# EAGLE design Jar of Fireflies (rev B) (EAGLE 7.1.0)
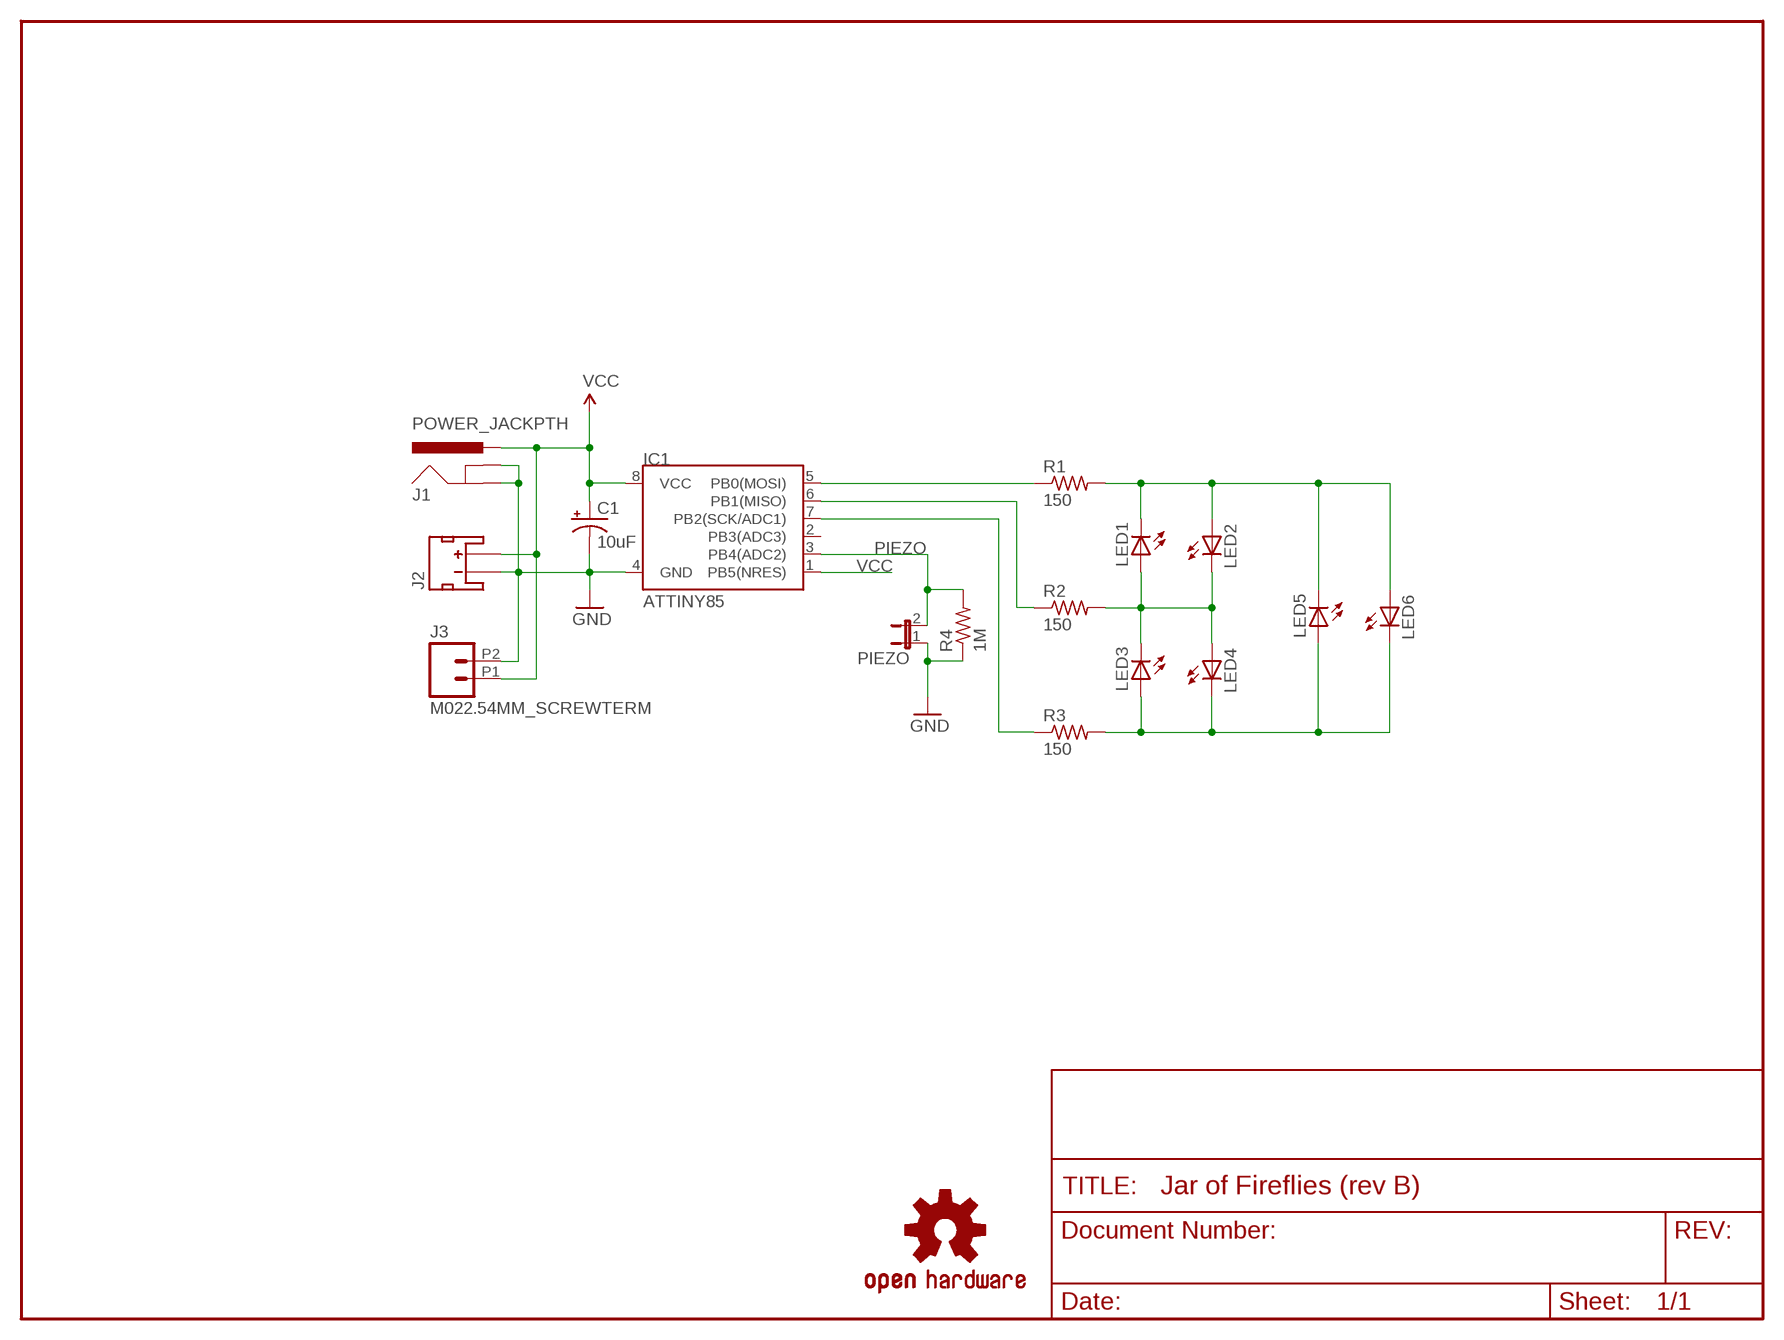
[diagram p0: schematic, sheet 1]

## Parts
C1  10uF  CAP_POLPTH2  [CPOL-RADIAL-10UF-25V]
IC1  ATTINY85  ATTINY45DIP8  [DIP08]
J1  POWER_JACKPTH  [POWER_JACK_PTH]
J2  JST_2MM_MALE  [JST-2-SMD]
J3  M022.54MM_SCREWTERM  [1X02_2.54_SCREWTERM]
LED1  LED5MM  [LED5MM]
LED2  LED5MM  [LED5MM]
LED3  LED5MM  [LED5MM]
LED4  LED5MM  [LED5MM]
LED5  LED5MM  [LED5MM]
LED6  LED5MM  [LED5MM]
LOGO1  OSHW-LOGOL  [OSHW-LOGO-L]
PIEZO  JUMPER-2PTH  [1X02]
R1  150  R-US_0207/2V  [0207/2V]
R2  150  R-US_0204/7  [0204/7]
R3  150  R-US_0207/2V  [0207/2V]
R4  1M  R-US_0204/7  [0204/7]

## Nets
GND: C1.2(-) IC1.4(GND) J1.GND J1.GNDBREAK J2.1(-) J3.P2 PIEZO.1 R4.1
N$1: LED1.A LED2.K(C) LED3.K(C) LED4.A R2.2
N$2: LED1.K(C) LED2.A LED5.K(C) LED6.A R1.2
N$3: LED3.A LED4.K(C) LED5.A LED6.K(C) R3.2
PIEZO: IC1.3(PB4(ADC2)) PIEZO.2 R4.2
PORTA: IC1.5(PB0(MOSI)) R1.1
PORTB: IC1.6(PB1(MISO)) R2.1
PORTC: IC1.7(PB2(SCK/ADC1)) R3.1
VCC: C1.1(+) IC1.1(PB5(NRES)) IC1.8(VCC) J1.PWR J2.2(+) J3.P1
Unconnected: IC1.2(PB3(ADC3)) J2.NC1(PAD1) J2.NC2(PAD2)

## Library data of the parts
C1 = SparkFun-Capacitors:CAP_POL: Capacitor Polarized These are standard SMD and PTH capacitors. Normally 10uF, 47uF, and 100uF in electrolytic and tantalum varieties. Always verify the external diameter of the through hole cap, it varies with capacity, voltage, and manufacturer. The EIA devices should be standard.
IC1 = SparkFun:ATTINY45: Atmel ATTiny45
J1 = SparkFun-Connectors:POWER_JACK: Power Jack This is the standard 5.5mm barrel jack for power. The PTH is the most common, proven, reliable, footprint. The Slot footprint only works if the mill layer is transmitted to the PCB fab house so be warned. Spark Fun Electronics SKU : PRT-00119 SMT: CONN-08106 Mating wall wart : TOL-00298 (and others)
J2 = SparkFun-Connectors:JST_2MM_MALE: Mates to single-cell LiPo batteries. CONN-08352; PROD_ID: CONN-08352
J3 = SparkFun-Connectors:M02: Standard 2-pin 0.1" header. Use with - straight break away headers ( PRT-00116) - right angle break away headers (PRT-00553) - swiss pins (PRT-00743) - machine pins (PRT-00117) - female headers (PRT-00115) Molex polarized connector foot print use with: PRT-08233 with associated crimp pins and housings. 2.54_SCREWTERM for use with PRT-10571. 3.5mm Screw Terminal footprints for PRT-08084 5mm Screw Terminal footprints for use with PRT-08433
LED1-LED6 = SparkFun:LED: LEDs Standard schematic elements and footprints for 5mm, 3mm, 1206, and 0603 sized LEDs. 5mm - Spark Fun Electronics SKU : COM-00529 (and others)
LOGO1 = SparkFun-Aesthetics:OSHW-LOGO: Open Source Hardware Logo This logo indicates the piece of hardware it is found on incorporates a OSHW license and/or adheres to the definition of open source hardware found here: http://freedomdefined.org/OSHW
PIEZO = SparkFun:JUMPER-2: Jumper Basic 0.1" spaced jumper. Use with breakaway headers.
R1-R4 = resistor:R-US_: RESISTOR, American symbol

## Board
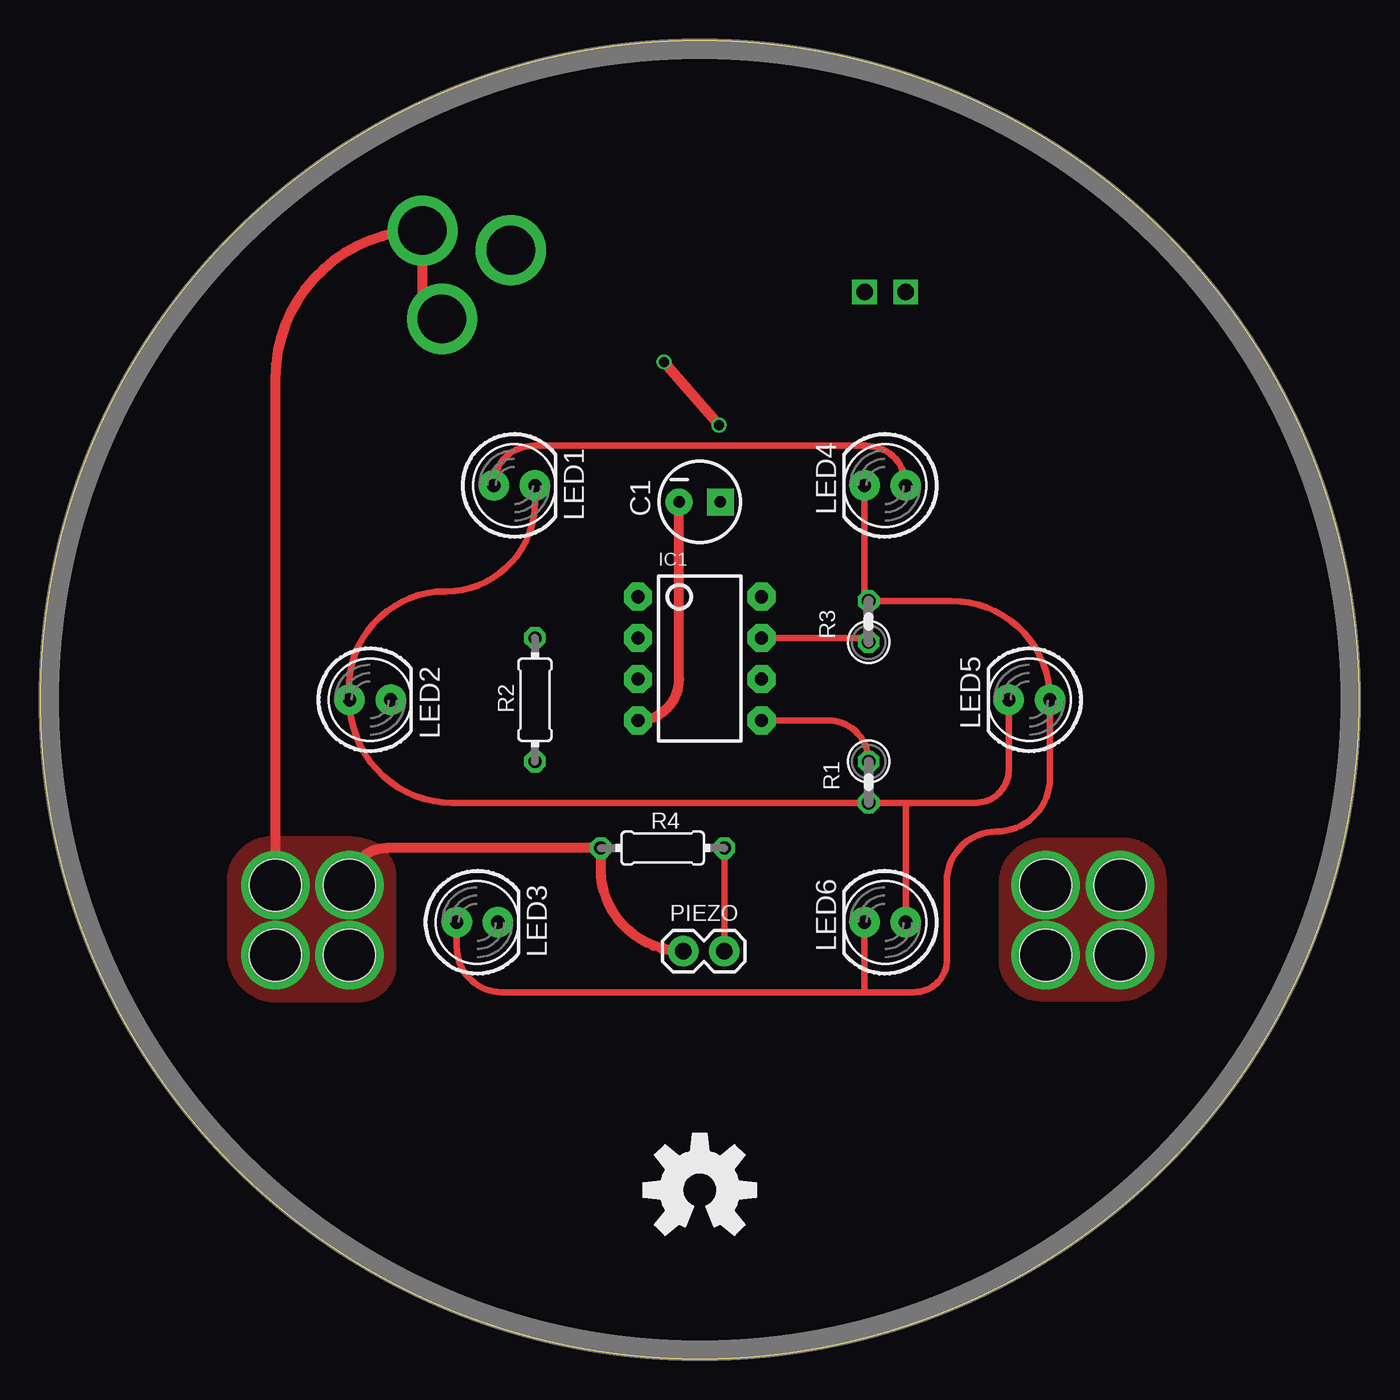
[diagram p1: board, top side]
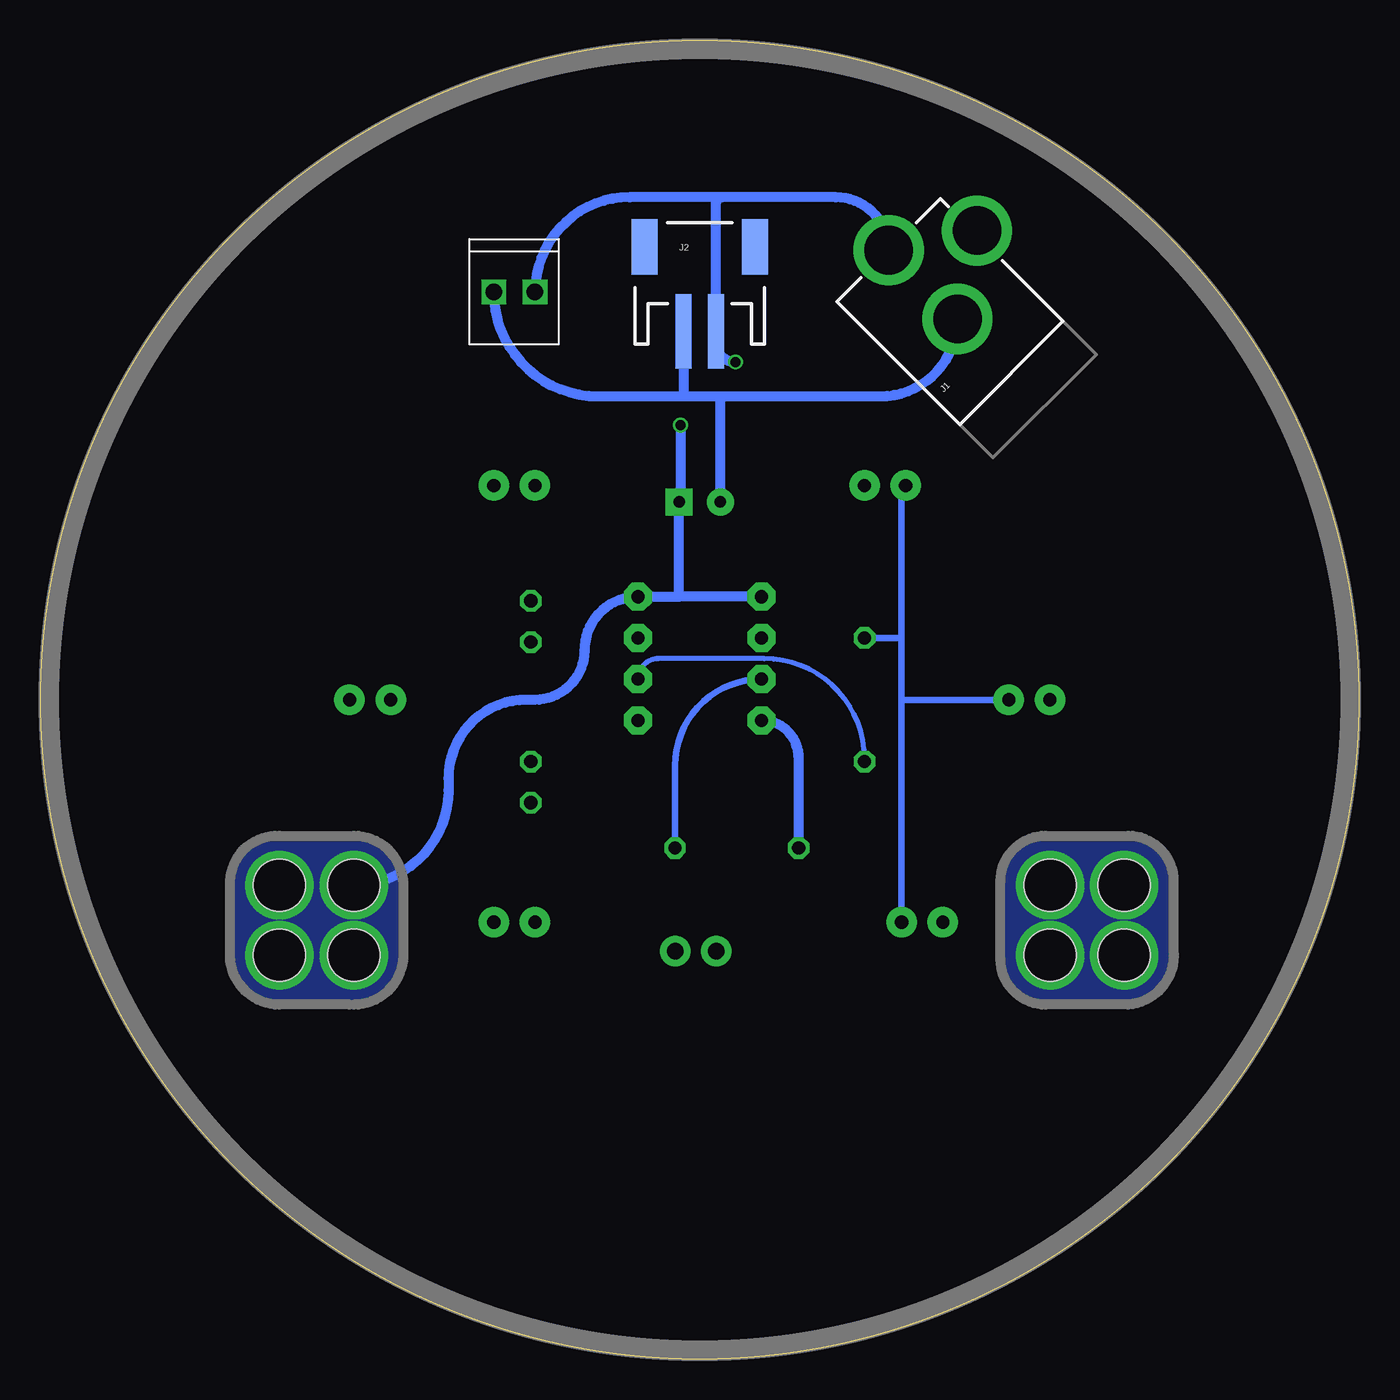
[diagram p2: board, bottom side, seen from below]

Size 81.28 x 81.28 mm. Coordinates in mm from the lower left corner, seen from the top.
Outline: circle at 40.64,40.64 radius 40.64
Copper layers (1*16): Top 0.035mm / dielectric 1.5mm / Bottom 0.035mm
Design rules "SeeedStudio_2layer_DRU_no_angle_20140221": minimum track width 6mil, minimum drill 12mil, track to track 6mil, track to pad 6mil, pad to pad 6mil, via to via 6mil, smd to smd 0mil, copper to edge 10mil, drill to drill 10mil, minimum pad ring 10mil, minimum via ring 6mil, stop-mask expansion 2mil, vias tented up to drill 100mil, thermal gap 10mil
Holes 3.2 mm at 19.05,24.89 19.05,29.21 61.98,29.21 61.98,24.89 14.48,29.21 14.48,24.89 66.55,29.21 66.55,24.89

### Footprints (pad centres in the part's own frame; a part is rotated, then mirrored left to right if it is on the bottom)
CPOL-RADIAL-10UF-25V = drill 0.7 pad 1.651 square: 1 1.27,0 | drill 0.7 pad 1.651: 2 -1.27,0
DIP08 = drill 0.813 pad 1.727 octagon: 1 -3.81,-3.81; 2 -1.27,-3.81; 3 1.27,-3.81; 4 3.81,-3.81; 5 3.81,3.81; 6 1.27,3.81; 7 -1.27,3.81; 8 -3.81,3.81
POWER_JACK_PTH = drill 2.997 pad 4.318: GND 0,7.7; GNDBREAK 4.7,10.7; PWR 0,13.7
JST-2-SMD = smd 1 x 4.6: 1 -1,-3.7; 2 1,-3.7 | smd 1.6 x 3.4: NC1 -3.4,1.5; NC2 3.4,1.5
1X02_2.54_SCREWTERM = drill 1.016 square: P1 2.54,0; P2 0,0
LED5MM = drill 0.813 pad 1.88: A -1.27,0; K 1.27,0
1X02 = drill 1.016 pad 1.88: 1 0,0; 2 2.54,0
0207/2V = drill 0.813 octagon: 1 -1.27,0; 2 1.27,0
0204/7 = drill 0.813 octagon: 1 -3.81,0; 2 3.81,0

### Placement (x,y rotation side)
C1  40.64,52.83 0 top
IC1  40.64,43.18 270 top
J1  19.3,58.67 45 bottom
J2  40.64,67.06 0 bottom
J3  53.34,65.79 0 bottom
LED1  29.21,53.85 0 top
LED2  20.32,40.64 0 top
LED3  26.92,26.92 0 top
LED4  52.07,53.85 180 top
LED5  60.96,40.64 180 top
LED6  52.07,26.92 180 top
LOGO1  40.64,10.41 0 top
PIEZO  39.62,25.15 0 top
R1  51.05,35.56 270 top
R2  30.48,40.64 90 top
R3  51.05,45.47 90 top
R4  38.35,31.5 0 top

### Tracks (layer width: path | path; a pad name or v marks a point on that pad's centre or on a via)
GND  (via drill 3.2)
  Top 0.61: v14.48,29.21 14.48,60.49 arc-90 J1.GNDBREAK 23.55,65.32 arc90 J1.GND | PIEZO.1 arc-90 34.54,30.23 R4.1 21.34,31.5 arc90 v19.05,29.21 | IC1.4 arc90 39.37,41.91 C1.2
  Bottom 0.61: R4.1 34.54,37.08 arc-90 IC1.4 | J3.P2 arc-90 46.9,59.34 41.48,59.34 | 41.48,59.34 39.62,59.34 | C1.2 39.37,59.09 arc-90 39.62,59.34 | J2.1 41.64,59.5 arc-90 41.48,59.34 | 39.62,59.34 29.52,59.34 arc-90 J1.GND
  other vias: 19.05,24.89 14.48,24.89
  pour Top: 19.3,22.1 19.56,22.1 arc90 21.84,24.38 21.84,29.63 arc73 20.15,31.92 arc13 19.22,32.09 14.22,32.09 14.22,32.09 arc90 11.6,29.46 11.6,25.06 arc90 14.56,22.1 19.22,22.1
  pour Bottom: 19.3,22.1 19.56,22.1 arc90 21.84,24.38 21.84,29.63 arc73 20.15,31.92 arc13 19.22,32.09 14.22,32.09 14.22,32.09 arc90 11.6,29.46 11.6,25.06 arc90 14.56,22.1 19.22,22.1
N$1
  Top 0.406: LED4.A arc90 50.89,56.3 30.39,56.3 arc90 LED1.A
  Bottom 0.406: LED3.K 28.19,40.64 | 28.19,40.64 28.19,44.45 | 28.19,44.45 28.19,53.59 LED1.A | R2.2 28.19,44.45 | LED2.K 28.19,40.64
N$2
  Top 0.406: LED5.K 59.69,36.32 arc-90 57.66,34.29 53.59,34.29 | 53.59,34.29 R1.2 25.4,34.29 arc-90 LED2.A arc-97 24.97,47.32 arc90 30.48,52.83 LED1.K | LED6.A 53.34,34.04 arc-90 53.59,34.29
N$3
  Top 0.406: LED4.K 50.8,46.99 arc90 R3.2 56.13,46.74 arc-90 LED5.A 62.23,35.81 arc-90 58.93,32.51 arc90 55.88,29.46 55.88,24.64 arc-90 53.85,22.61 50.8,22.61 | 50.8,22.61 28.45,22.61 arc-90 25.65,25.4 LED3.A | LED6.K 50.8,22.61
PIEZO
  Top 0.406: PIEZO.2 R4.2
  Bottom 0.406: IC1.3 arc-90 42.16,36.58 R4.2
PORTA
  Top 0.406: IC1.5 48.51,39.37 arc-90 R1.1
PORTB
  Bottom 0.305: R2.1 30.48,37 arc-90 36.66,43.18 43.18,43.18 arc-90 IC1.6
PORTC
  Top 0.406: IC1.7 50.8,44.45 arc-90 R3.1
VCC  (via drill 0.6, 3.2)
  Top 0.61: v38.44,61.46 v41.82,57.57
  Bottom 0.61: IC1.1 41.91,46.99 | 41.91,46.99 41.91,52.32 | 41.91,52.32 C1.1 | 41.91,46.99 IC1.8 arc-90 47.75,43.69 arc90 50.8,40.64 51.31,40.64 arc-90 56.13,35.81 56.13,35.05 arc90 v61.98,29.21 | J1.PWR arc-90 32.25,71.62 39.28,71.62 | 39.28,71.62 arc-90 39.64,71.26 J2.2 39.64,62.67 arc-90 v38.44,61.46 | 41.91,52.32 arc-90 41.82,52.41 v41.82,57.57 | 39.28,71.62 44.97,71.62 arc-90 J3.P1
  other vias: 66.55,29.21 66.55,24.89 61.98,24.89
  pour Top: 66.63,22.18 arc90 69.34,24.89 69.34,29.46 arc90 66.8,32 62.05,32 61.89,32 arc90 59.18,29.29 59.18,24.64 arc90 61.63,22.18
  pour Bottom: 66.63,22.18 arc90 69.34,24.89 69.34,29.46 arc90 66.8,32 62.05,32 61.89,32 arc90 59.18,29.29 59.18,24.64 arc90 61.63,22.18

### Text on the board
tValues: 10uF
tDocu: REV B | OSHW
bDocu: + | - | - | +